# EAGLE schematic Board_v1 (EAGLE 9.2.2)
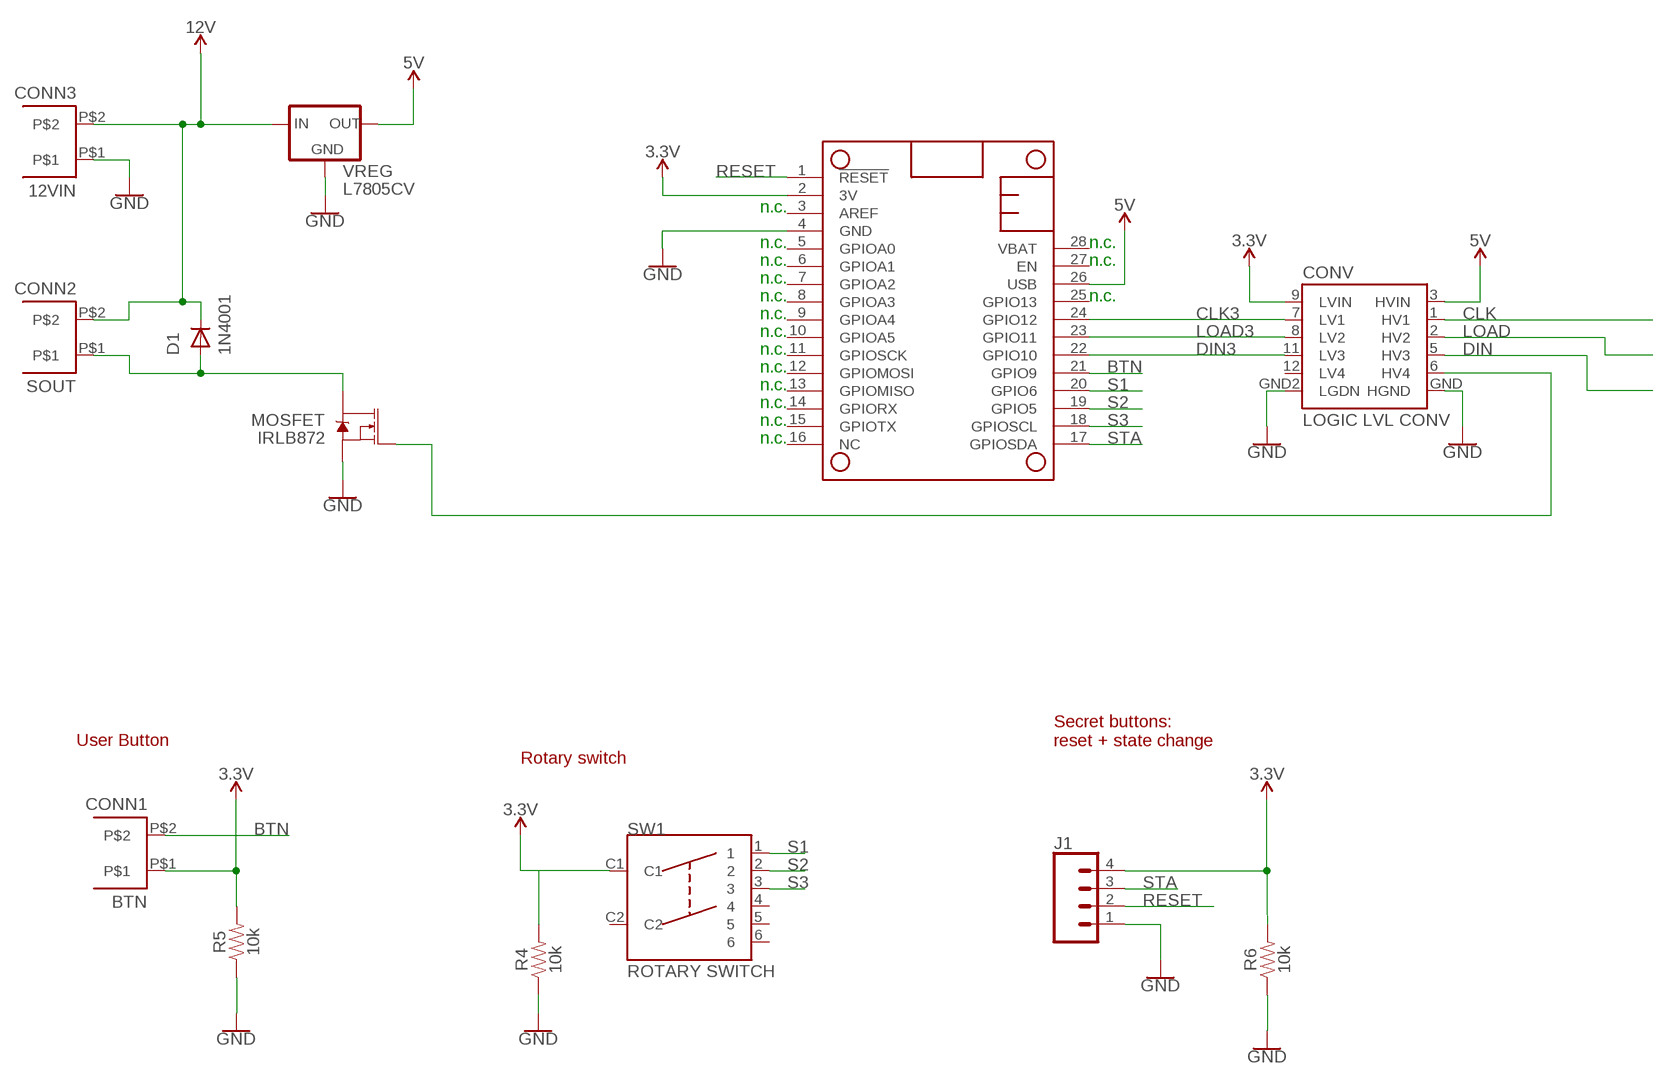
[diagram p0: schematic, sheet 1, part 1 of 3]
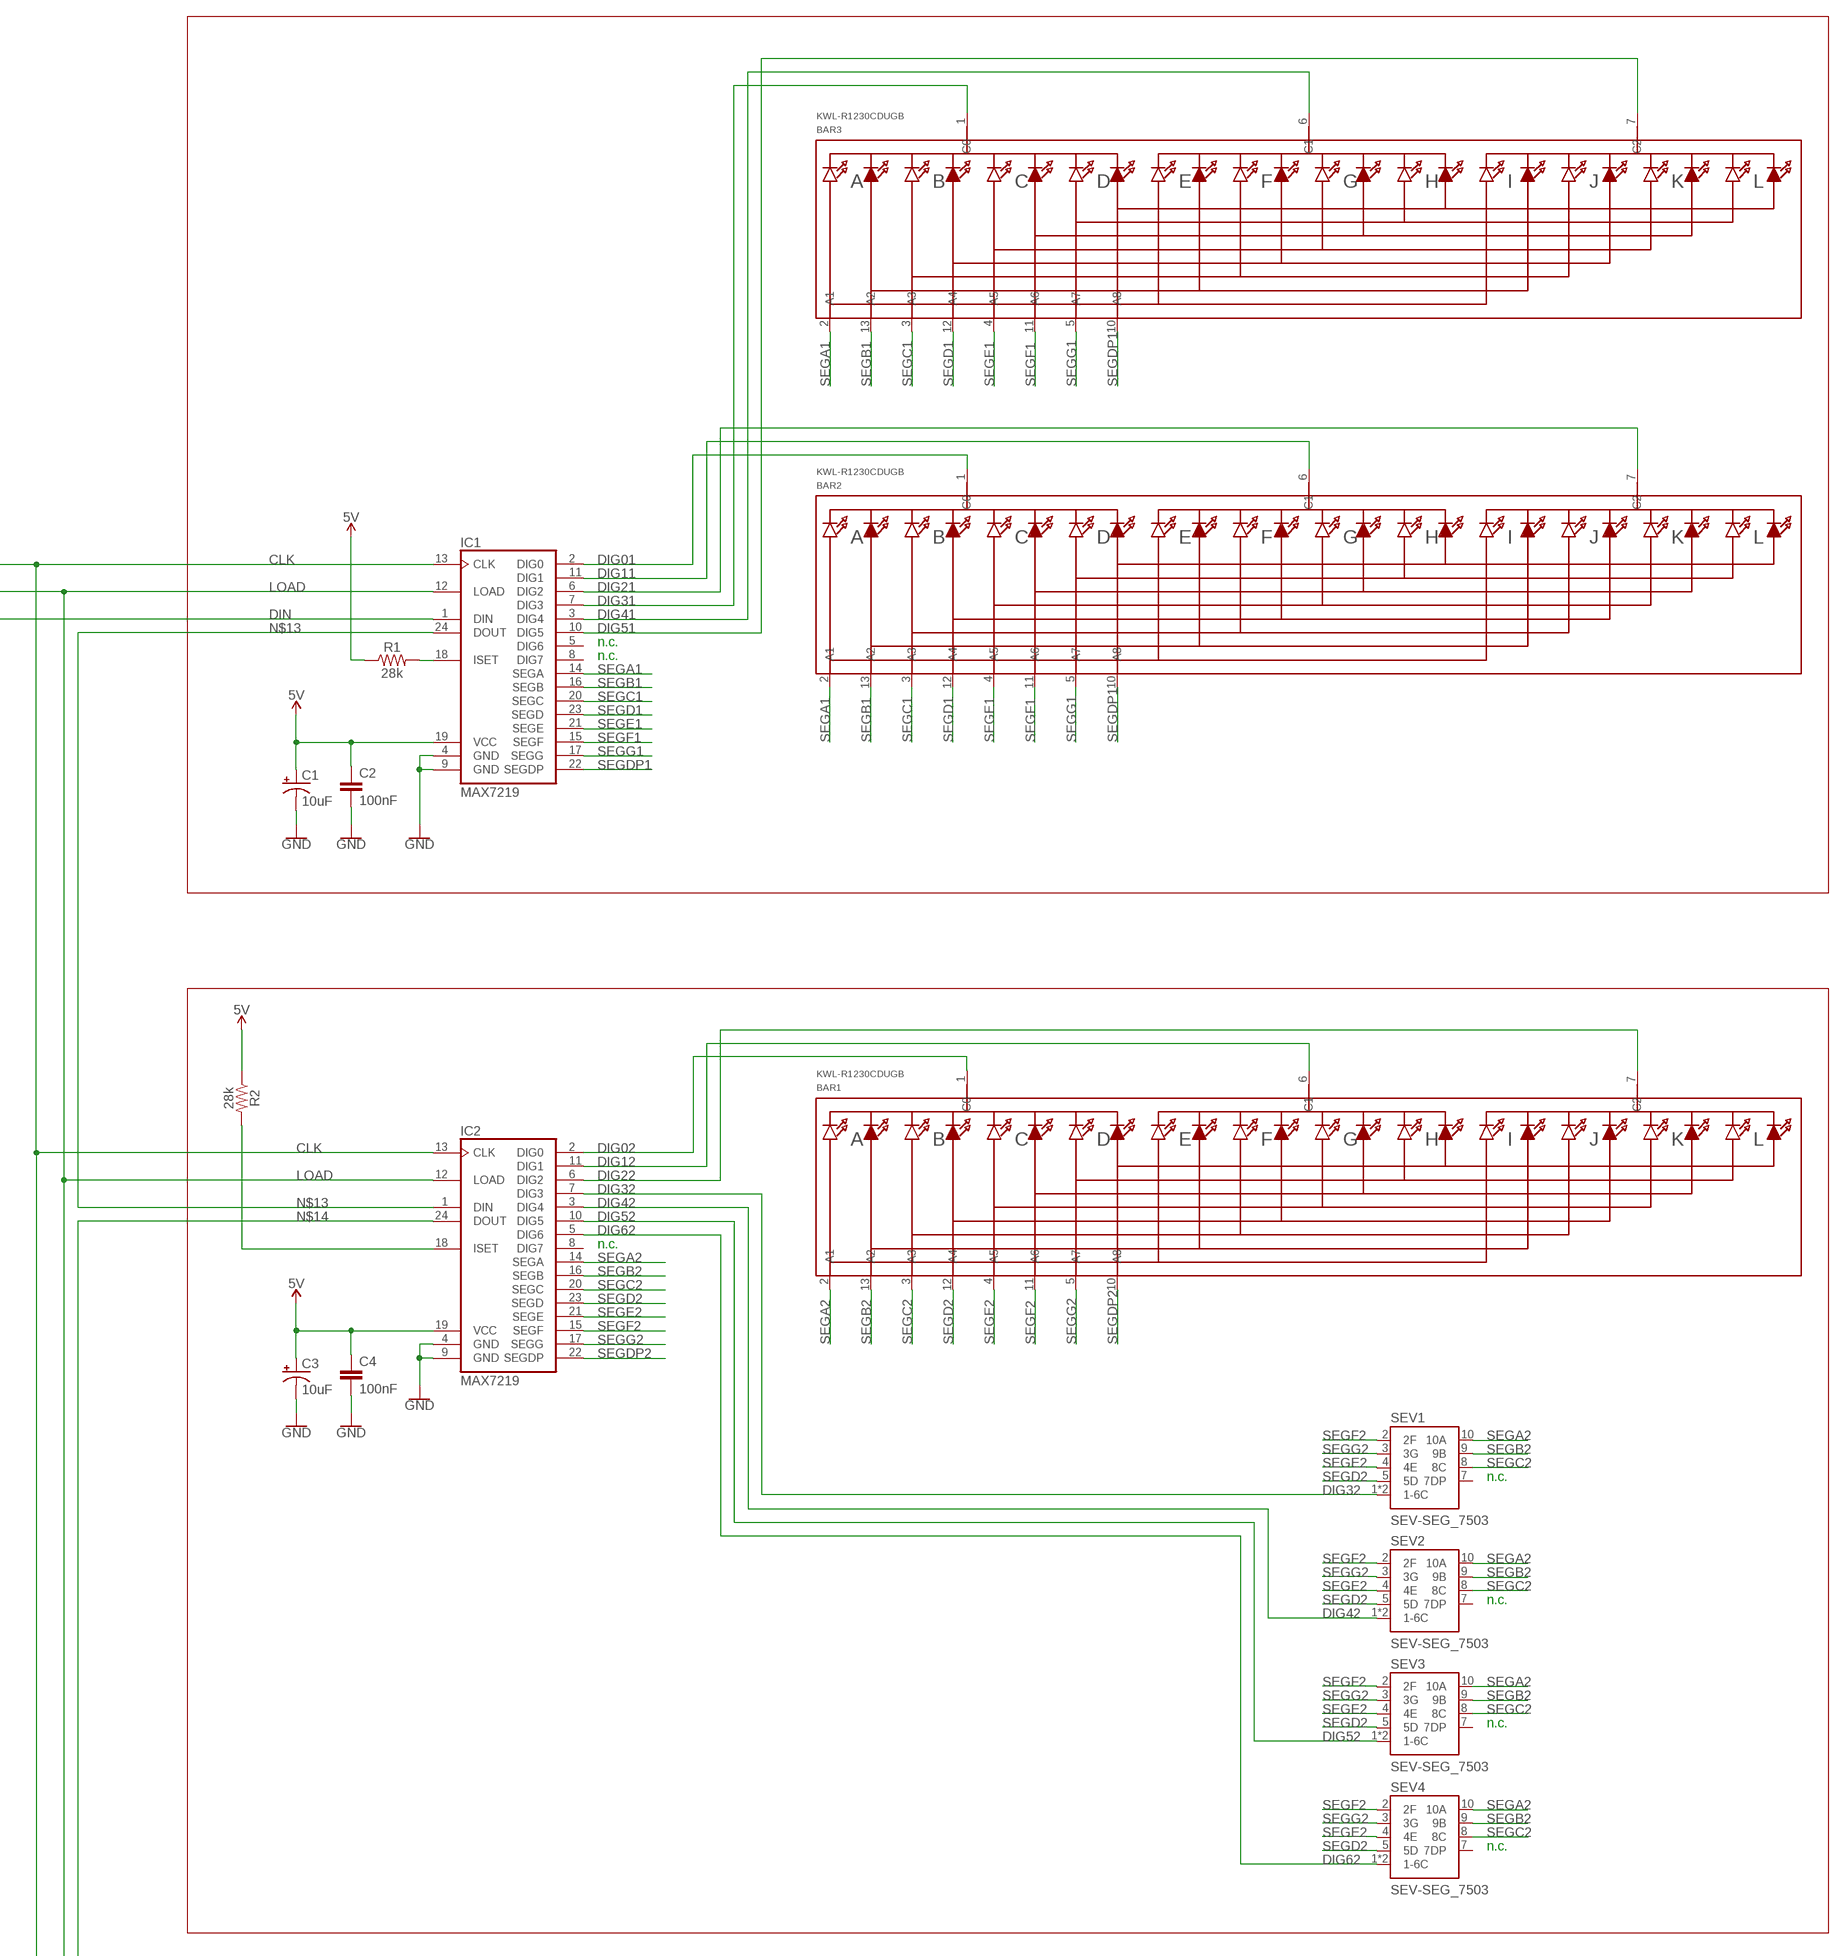
[diagram p1: schematic, sheet 1, part 2 of 3]
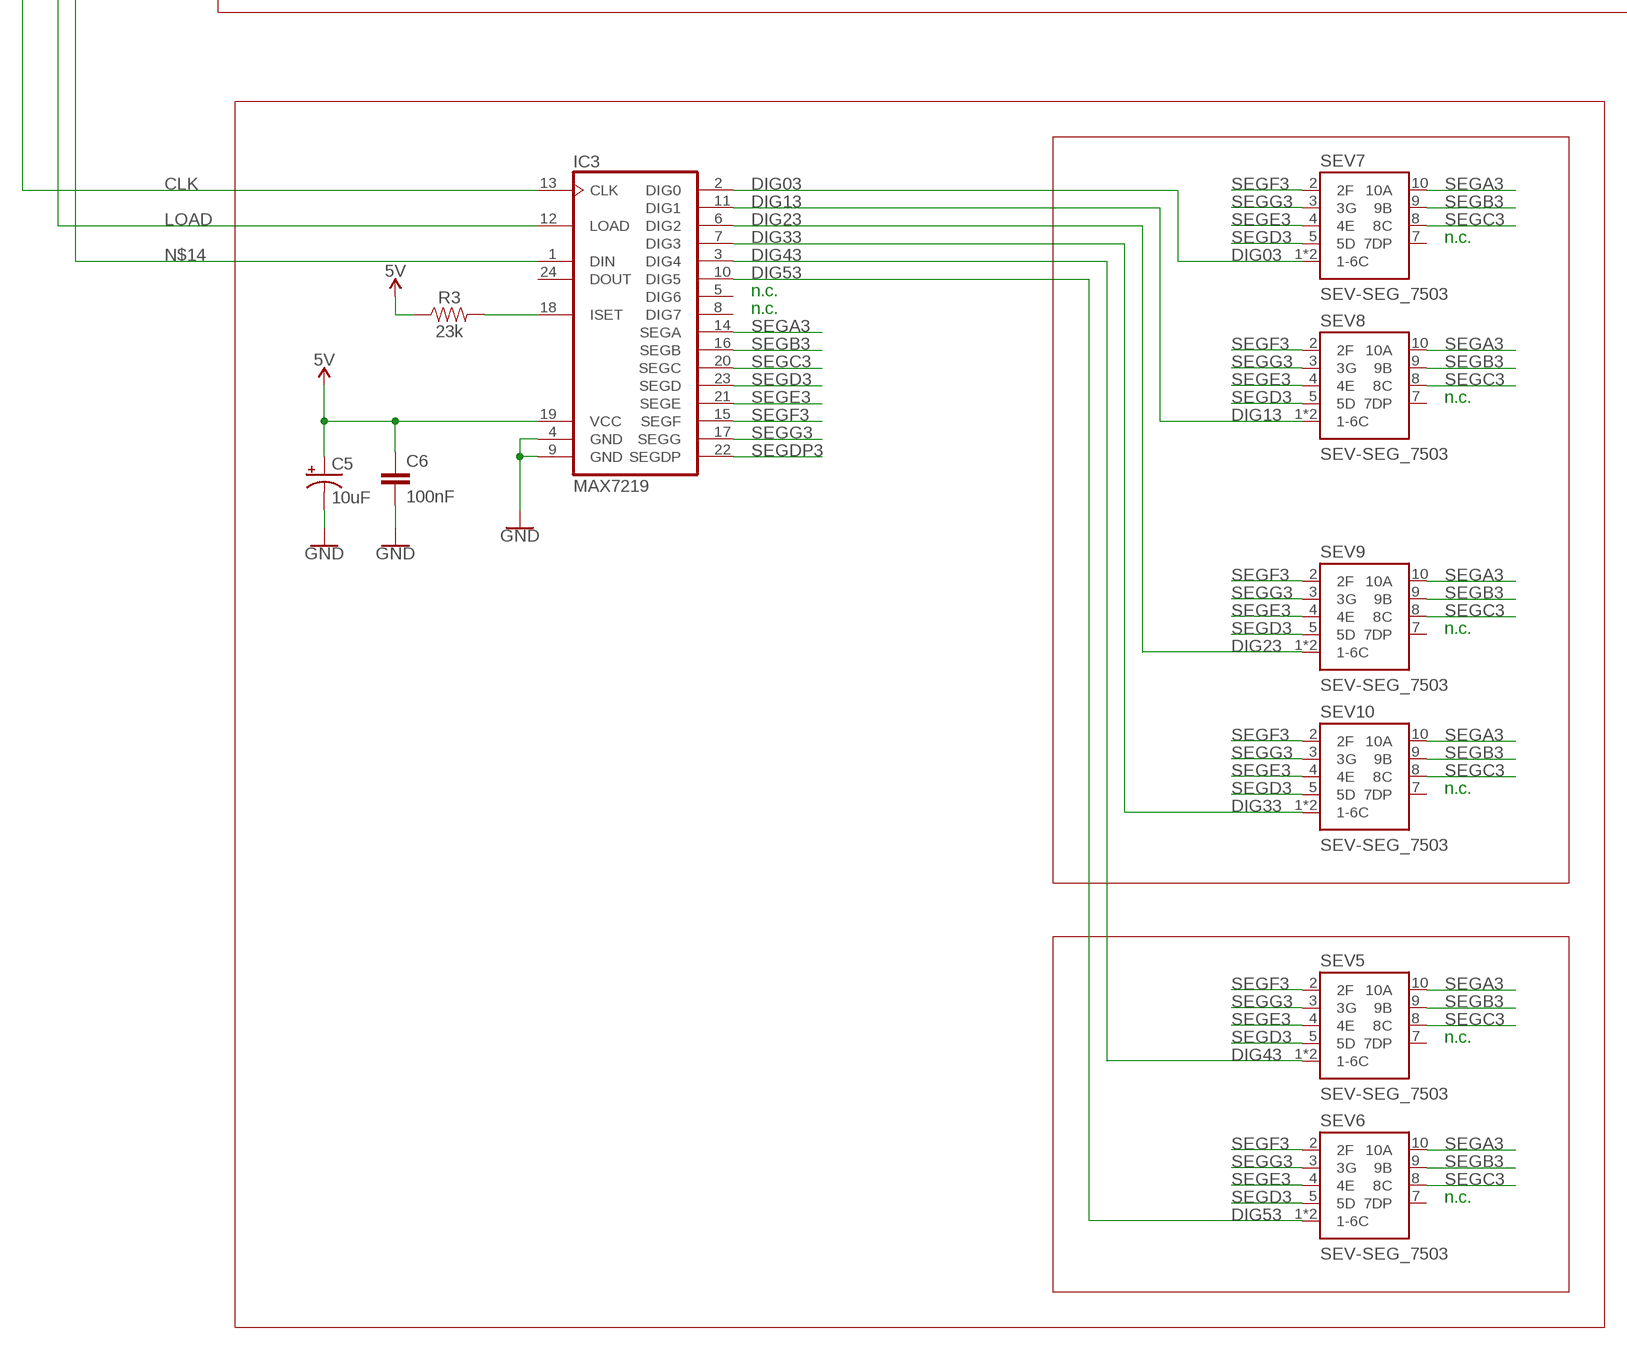
[diagram p2: schematic, sheet 1, part 3 of 3]

## Parts
12VIN  CONN3  MICRO-FIT_3.0_43650  [MICRO-FIT_43560_3MM]
BAR1  KWL-R1230CDUGB  [SEGMENT_BICOL_BL-AR12Z3010]
BAR2  KWL-R1230CDUGB  [SEGMENT_BICOL_BL-AR12Z3010]
BAR3  KWL-R1230CDUGB  [SEGMENT_BICOL_BL-AR12Z3010]
BTN  CONN1  MICRO-FIT_3.0_43650  [MICRO-FIT_43560_3MM]
C1  10uF  CAP_POL  [CPOL-RADIAL-2.5MM-5MM-KIT]
C2  100nF  CAP_CERAMIC  [CAP-PTH-5MM]
C3  10uF  CAP_POL  [CPOL-RADIAL-2.5MM-5MM-KIT]
C4  100nF  CAP_CERAMIC  [CAP-PTH-5MM]
C5  10uF  CAP_POL  [CPOL-RADIAL-2.5MM-5MM-KIT]
C6  100nF  CAP_CERAMIC  [CAP-PTH-5MM]
CONV  LOGIC LVL CONV  3-5V_LOGIC_LVL_CONV  [3-5V_LOGIC_LVL_CONV]
D1  1N4001  [CASE59−10-AXIAL]
FEATHERM0  FEATHERWING_NODIM  [FEATHER]
IC1  MAX7219  MAX7219CNG  [DIL24-3]
IC2  MAX7219  MAX7219CNG  [DIL24-3]
IC3  MAX7219  MAX7219CNG  [DIL24-3]
J1  CONN_041X04_NO_SILK  [1X04_NO_SILK]
MOSFET  IRLB872  [TO-220-ALT]
R1  28k  RESISTOR  [AXIAL-0.3]
R2  28k  RESISTOR  [AXIAL-0.3]
R3  23k  RESISTOR  [AXIAL-0.3]
R4  10k  RESISTOR  [AXIAL-0.3]
R5  10k  RESISTOR  [AXIAL-0.3]
R6  10k  RESISTOR  [AXIAL-0.3]
SEV1  SEV-SEG_7503  [HDSP-7503-C]
SEV2  SEV-SEG_7503  [HDSP-7503-C]
SEV3  SEV-SEG_7503  [HDSP-7503-C]
SEV4  SEV-SEG_7503  [HDSP-7503-C]
SEV5  SEV-SEG_7503  [HDSP-7503-C]
SEV6  SEV-SEG_7503  [HDSP-7503-C]
SEV7  SEV-SEG_7503  [HDSP-7503-C]
SEV8  SEV-SEG_7503  [HDSP-7503-C]
SEV9  SEV-SEG_7503  [HDSP-7503-C]
SEV10  SEV-SEG_7503  [HDSP-7503-C]
SOUT  CONN2  MICRO-FIT_3.0_43650  [MICRO-FIT_43560_3MM]
SW1  ROTARY SWITCH  MRB_ROTARY_SWITCH  [MRB24B_SP3T]
VREG  L7805CV  [TO-220-ALT]

## Nets
3.3V: BTN.P$1 CONV.9(LVIN) FEATHERM0.2(3V) J1.4 R5.P$2 R6.P$2
5V: C1.1(+) C2.1 C3.1(+) C4.1 C5.1(+) C6.1 CONV.3(HVIN) FEATHERM0.26(USB) IC1.19(VCC) IC2.19(VCC) IC3.19(VCC) R1.P$1 R2.P$1 R3.P$1 VREG.OUT
12V: 12VIN.P$2 D1.CAT(C) SOUT.P$2 VREG.IN
BTN: BTN.P$2 FEATHERM0.21(GPIO9)
CLK: CONV.1(HV1) IC1.13(CLK) IC2.13(CLK) IC3.13(CLK)
CLK3: CONV.7(LV1) FEATHERM0.24(GPIO12)
DIG01: BAR2.1(C0) IC1.2(DIG0)
DIG02: BAR1.1(C0) IC2.2(DIG0)
DIG03: IC3.2(DIG0) SEV7.1(1-6C) SEV7.6(1-6C)
DIG11: BAR2.6(C1) IC1.11(DIG1)
DIG12: BAR1.6(C1) IC2.11(DIG1)
DIG13: IC3.11(DIG1) SEV8.1(1-6C) SEV8.6(1-6C)
DIG21: BAR2.7(C2) IC1.6(DIG2)
DIG22: BAR1.7(C2) IC2.6(DIG2)
DIG23: IC3.6(DIG2) SEV9.1(1-6C) SEV9.6(1-6C)
DIG31: BAR3.1(C0) IC1.7(DIG3)
DIG32: IC2.7(DIG3) SEV1.1(1-6C) SEV1.6(1-6C)
DIG33: IC3.7(DIG3) SEV10.1(1-6C) SEV10.6(1-6C)
DIG41: BAR3.6(C1) IC1.3(DIG4)
DIG42: IC2.3(DIG4) SEV2.1(1-6C) SEV2.6(1-6C)
DIG43: IC3.3(DIG4) SEV5.1(1-6C) SEV5.6(1-6C)
DIG51: BAR3.7(C2) IC1.10(DIG5)
DIG52: IC2.10(DIG5) SEV3.1(1-6C) SEV3.6(1-6C)
DIG53: IC3.10(DIG5) SEV6.1(1-6C) SEV6.6(1-6C)
DIG62: IC2.5(DIG6) SEV4.1(1-6C) SEV4.6(1-6C)
DIN: CONV.5(HV3) IC1.1(DIN)
DIN3: CONV.11(LV3) FEATHERM0.22(GPIO10)
GND: 12VIN.P$1 C1.2(-) C2.2 C3.2(-) C4.2 C5.2(-) C6.2 CONV.GND2(LGDN) CONV.GND(HGND) FEATHERM0.4(GND) IC1.4(GND) IC1.9(GND) IC2.4(GND) IC2.9(GND) IC3.4(GND) IC3.9(GND) J1.1 MOSFET.OUT(S) R4.P$1 R5.P$1 R6.P$1 VREG.GND
LOAD: CONV.2(HV2) IC1.12(LOAD) IC2.12(LOAD) IC3.12(LOAD)
LOAD3: CONV.8(LV2) FEATHERM0.23(GPIO11)
N$1: IC1.18(ISET) R1.P$2
N$2: D1.ANOD(A) MOSFET.GND(D) SOUT.P$1
N$3: CONV.6(HV4) MOSFET.IN(G)
N$7: R4.P$2 SW1.C1
N$8: IC3.18(ISET) R3.P$2
N$9: IC2.18(ISET) R2.P$2
N$13: IC1.24(DOUT) IC2.1(DIN)
N$14: IC2.24(DOUT) IC3.1(DIN)
RESET: FEATHERM0.1(!RESET) J1.2
S1: FEATHERM0.20(GPIO6) SW1.1
S2: FEATHERM0.19(GPIO5) SW1.2
S3: FEATHERM0.18(GPIOSCL) SW1.3
SEGA1: BAR2.2(A1) BAR3.2(A1) IC1.14(SEGA)
SEGA2: BAR1.2(A1) IC2.14(SEGA) SEV1.10(10A) SEV2.10(10A) SEV3.10(10A) SEV4.10(10A)
SEGA3: IC3.14(SEGA) SEV5.10(10A) SEV6.10(10A) SEV7.10(10A) SEV8.10(10A) SEV9.10(10A) SEV10.10(10A)
SEGB1: BAR2.13(A2) BAR3.13(A2) IC1.16(SEGB)
SEGB2: BAR1.13(A2) IC2.16(SEGB) SEV1.9(9B) SEV2.9(9B) SEV3.9(9B) SEV4.9(9B)
SEGB3: IC3.16(SEGB) SEV5.9(9B) SEV6.9(9B) SEV7.9(9B) SEV8.9(9B) SEV9.9(9B) SEV10.9(9B)
SEGC1: BAR2.3(A3) BAR3.3(A3) IC1.20(SEGC)
SEGC2: BAR1.3(A3) IC2.20(SEGC) SEV1.8(8C) SEV2.8(8C) SEV3.8(8C) SEV4.8(8C)
SEGC3: IC3.20(SEGC) SEV5.8(8C) SEV6.8(8C) SEV7.8(8C) SEV8.8(8C) SEV9.8(8C) SEV10.8(8C)
SEGD1: BAR2.12(A4) BAR3.12(A4) IC1.23(SEGD)
SEGD2: BAR1.12(A4) IC2.23(SEGD) SEV1.5(5D) SEV2.5(5D) SEV3.5(5D) SEV4.5(5D)
SEGD3: IC3.23(SEGD) SEV5.5(5D) SEV6.5(5D) SEV7.5(5D) SEV8.5(5D) SEV9.5(5D) SEV10.5(5D)
SEGDP1: BAR2.10(A8) BAR3.10(A8) IC1.22(SEGDP)
SEGDP2: BAR1.10(A8) IC2.22(SEGDP)
SEGDP3: IC3.22(SEGDP) SEV6.7(7DP) SEV7.7(7DP) SEV9.7(7DP)
SEGE1: BAR2.4(A5) BAR3.4(A5) IC1.21(SEGE)
SEGE2: BAR1.4(A5) IC2.21(SEGE) SEV1.4(4E) SEV2.4(4E) SEV3.4(4E) SEV4.4(4E)
SEGE3: IC3.21(SEGE) SEV5.4(4E) SEV6.4(4E) SEV7.4(4E) SEV8.4(4E) SEV9.4(4E) SEV10.4(4E)
SEGF1: BAR2.11(A6) BAR3.11(A6) IC1.15(SEGF)
SEGF2: BAR1.11(A6) IC2.15(SEGF) SEV1.2(2F) SEV2.2(2F) SEV3.2(2F) SEV4.2(2F)
SEGF3: IC3.15(SEGF) SEV5.2(2F) SEV6.2(2F) SEV7.2(2F) SEV8.2(2F) SEV9.2(2F) SEV10.2(2F)
SEGG1: BAR2.5(A7) BAR3.5(A7) IC1.17(SEGG)
SEGG2: BAR1.5(A7) IC2.17(SEGG) SEV1.3(3G) SEV2.3(3G) SEV3.3(3G) SEV4.3(3G)
SEGG3: IC3.17(SEGG) SEV5.3(3G) SEV6.3(3G) SEV7.3(3G) SEV8.3(3G) SEV9.3(3G) SEV10.3(3G)
STA: FEATHERM0.17(GPIOSDA) J1.3
Unconnected: CONV.12(LV4) FEATHERM0.3(AREF) FEATHERM0.5(GPIOA0) FEATHERM0.6(GPIOA1) FEATHERM0.7(GPIOA2) FEATHERM0.8(GPIOA3) FEATHERM0.9(GPIOA4) FEATHERM0.10(GPIOA5) FEATHERM0.11(GPIOSCK) FEATHERM0.12(GPIOMOSI) FEATHERM0.13(GPIOMISO) FEATHERM0.14(GPIORX) FEATHERM0.15(GPIOTX) FEATHERM0.16(NC) FEATHERM0.25(GPIO13) FEATHERM0.27(EN) FEATHERM0.28(VBAT) IC1.5(DIG6) IC1.8(DIG7) IC2.8(DIG7) IC3.5(DIG6) IC3.8(DIG7) IC3.24(DOUT) SEV1.7(7DP) SEV2.7(7DP) SEV3.7(7DP) SEV4.7(7DP) SEV5.7(7DP) SEV8.7(7DP) SEV10.7(7DP) SW1.4 SW1.5 SW1.6 SW1.C2

## Notes on the sheet
- n.c.
- n.c. | n.c.
- n.c. | n.c.
- n.c.
- n.c. | n.c.
- n.c.
- n.c.
- n.c.
- n.c.
- n.c.
- n.c.
- n.c. | n.c.
- n.c. | n.c.
- User Button
- Secret buttons:
  reset + state change
- Rotary switch
- n.c.
- n.c.
- n.c.
- n.c.
- n.c.
- n.c.
- n.c.
- n.c.
- n.c.
- n.c.
- n.c.
- n.c.
- n.c.

## Library data of the parts
12VIN BTN SOUT = AES_lib:MICRO-FIT_3.0_43650
BAR1-BAR3 = AES_lib:KWL-R1230CDUGB
C1 C3 C5 = AES_lib:CAP_POL
C2 C4 C6 = AES_lib:CAP_CERAMIC
CONV = AES_lib:3-5V_LOGIC_LVL_CONV
D1 = AES_lib:1N4001
FEATHERM0 = AES_lib:FEATHERWING
IC1-IC3 = AES_lib:MAX7219CNG: LED DISPLAY DRIVER; MF: MAXIM; MPN: MAX7219CNG; OC_FARNELL: 1523914; OC_NEWARK: 34C4018
J1 = SparkFun-Connectors:CONN_04: Multi connection point. Often used as Generic Header-pin footprint for 0.1 inch spaced/style header connections On any of the 0.1 inch spaced packages, you can populate with these: Break Away Headers - Straight <https://www.sparkfun.com/products/116> (PRT-00116) Break Away Male Headers - Right Angle <https://www.sparkfun.com/products/553> (PRT-00553) Female Headers <https://www.sparkfun.com/products/115> (PRT-00115) Break Away Headers - Machine Pin <https://www.sparkfun.com/products/117> (PRT-00117) Break Away Female Headers - Swiss Machine Pin <https://www.sparkfun.com/products/743> (PRT-00743) For SCREWTERMINALS and SPRING TERMINALS visit here: Screw Terimnals on SparkFun.com <https://www.sparkfun.com/search/results?term=Screw+Terminals> (5mm/3.5mm/2.54mm spacing) This device is also useful as a general connection point to wire up your design to another part of your project. Our various solder wires solder well into these plated through hole pads. Hook-Up Wire - Assortment (Stranded, 22 AWG) <https://www.sparkfun.com/products/11375> (PRT-11375) Hook-Up Wire - Assortment (Solid Core, 22 AWG) <https://www.sparkfun.com/products/11367> (PRT-11367) View the entire wire category on our website here <https://www.sparkfun.com/categories/141> Special notes: Molex polarized connector foot print use with SKU : PRT-08231 with associated crimp pins and housings. 1MM SMD Version SKU: PRT-10208; PROD_ID: CONN-09696
MOSFET = AES_lib:IRLB872
R1-R6 = AES_lib:RESISTOR
SEV1-SEV10 = AES_lib:SEV-SEG_7503
SW1 = AES_lib:MRB_ROTARY_SWITCH
VREG = AES_lib:L7805CV